# Altium project 电池架充电板.PrjPcb
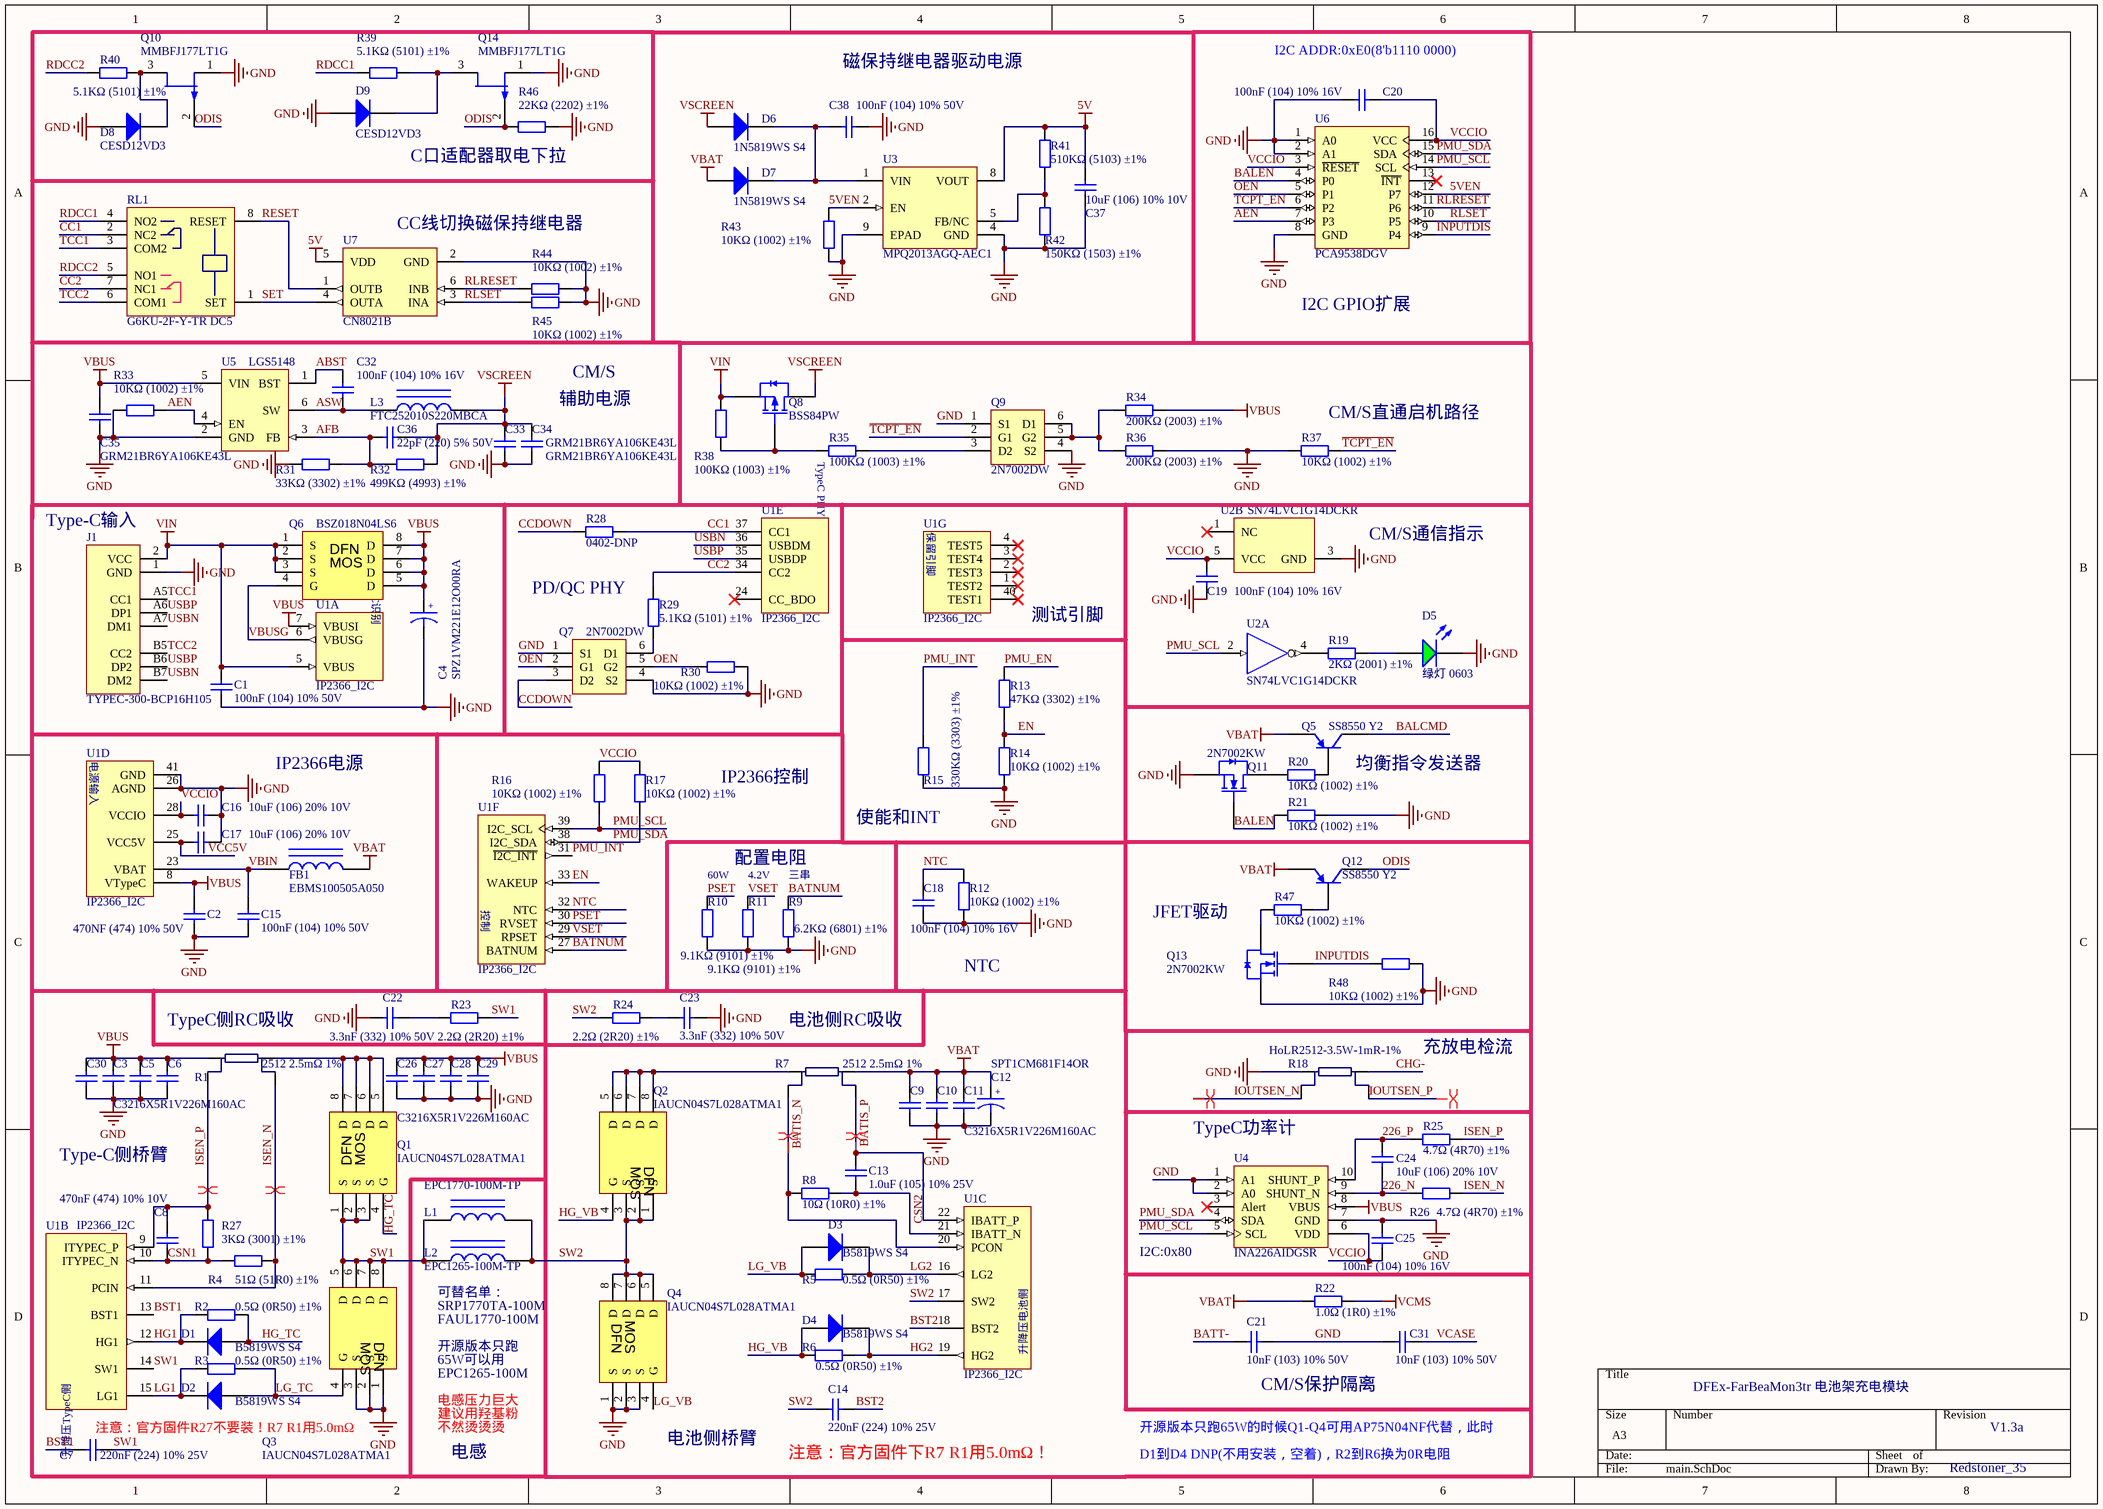
[diagram p0: main.SchDoc]
1 sheet, 122 parts. Net scope: global (net labels, ports and power ports of the same name join across sheets).
Board file: PCB2.PcbDoc

## Sheet main.SchDoc
size A3

### Parts
C1  100nF (104) 10% 50V  [0402_C]
C2  470NF (474) 10% 50V  [0402_C]
C3  C3216X5R1V226M160AC  [1206C]
C4  SPZ1VM221E12O00RA  [ElecCap_Hori]
C5  C3216X5R1V226M160AC  [1206C]  (value not drawn)
C6  C3216X5R1V226M160AC  [1206C]  (value not drawn)
C7  220nF (224) 10% 25V  [0603_C]
C8  470nF (474) 10% 10V  [0402_C]
C9  C3216X5R1V226M160AC  [1206C]  (value not drawn)
C10  C3216X5R1V226M160AC  [1206C]  (value not drawn)
C11  C3216X5R1V226M160AC  [1206C]
C12  SPT1CM681F14OR  [ElecCap_Hori]
C13  1.0uF (105) 10% 25V  [0402_C]
C14  220nF (224) 10% 25V  [0603_C]
C15  100nF (104) 10% 50V  [0402_C]
C16  10uF (106) 20% 10V  [0402_C]
C17  10uF (106) 20% 10V  [0402_C]
C18  100nF (104) 10% 16V  [0402_C]
C19  100nF (104) 10% 16V  [0402_C]
C20  100nF (104) 10% 16V  [0402_C]
C21  10nF (103) 10% 50V  [0402_C]
C22  3.3nF (332) 10% 50V  [0603_C]
C23  3.3nF (332) 10% 50V  [0603_C]
C24  10uF (106) 20% 10V  [0402_C]
C25  100nF (104) 10% 16V  [0402_C]
C26  C3216X5R1V226M160AC  [1206C]  (value not drawn)
C27  C3216X5R1V226M160AC  [1206C]
C28  C3216X5R1V226M160AC  [1206C]  (value not drawn)
C29  C3216X5R1V226M160AC  [1206C]  (value not drawn)
C30  C3216X5R1V226M160AC  [1206C]  (value not drawn)
C31  10nF (103) 10% 50V  [0402_C]
C32  100nF (104) 10% 16V  [0402_C]
C33  GRM21BR6YA106KE43L  [0805_C]
C34  GRM21BR6YA106KE43L  [0805_C]
C35  GRM21BR6YA106KE43L  [0805_C]
C36  22pF (220) 5% 50V  [0402_C]
C37  10uF (106) 10% 10V  [0603_C]
C38  100nF (104) 10% 50V  [0402_C]
D1  B5819WS S4  [SOD-323]
D2  B5819WS S4  [SOD-323]
D3  B5819WS S4  [SOD-323]
D4  B5819WS S4  [SOD-323]
D5  绿灯 0603  [0603_LED_S1]
D6  1N5819WS S4  [SOD-323]
D7  1N5819WS S4  [SOD-323]
D8  CESD12VD3  [SOD-323]
D9  CESD12VD3  [SOD-323]
FB1  EBMS100505A050  [0402_L]
J1  TYPEC-300-BCP16H105  [TYPE-C-SMD_TYPE-C16PIN]
L1  EPC1770-100M-TP  [IND1770-HD]
L2  EPC1265-100M-TP  [EPC1265-xxxM]
L3  FTC252010S220MBCA  [SWPA252010S]
Q1  IAUCN04S7L028ATMA1  [SON/DFN5x6(MOS)]
Q2  IAUCN04S7L028ATMA1  [SON/DFN5x6(MOS)]
Q3  IAUCN04S7L028ATMA1  [SON/DFN5x6(MOS)]
Q4  IAUCN04S7L028ATMA1  [SON/DFN5x6(MOS)]
Q5  SS8550 Y2  [SOT-23(SOT-23-3)]
Q6  BSZ018N04LS6  [DFN-8_L3.0-W3.0-P0.65-BL]
Q7  2N7002DW  [SC70-6]
Q8  BSS84PW  [SC70-3]
Q9  2N7002DW  [SC70-6]
Q10  MMBFJ177LT1G  [SOT-23_N]
Q11  2N7002KW  [SC70-3]
Q12  SS8550 Y2  [SC70-3]
Q13  2N7002KW  [SC70-3]
Q14  MMBFJ177LT1G  [SOT-23_N]
R1  2512 2.5mΩ 1%  [2512-Virtual4Wire]
R2  0.5Ω (0R50) ±1%  [0603_R]
R3  0.5Ω (0R50) ±1%  [0603_R]
R4  51Ω (51R0) ±1%  [0402_R]
R5  0.5Ω (0R50) ±1%  [0603_R]
R6  0.5Ω (0R50) ±1%  [0603_R]
R7  2512 2.5mΩ 1%  [2512-Virtual4Wire]
R8  10Ω (10R0) ±1%  [0402_R]
R9  6.2KΩ (6801) ±1%  [0402_R]
R10  9.1KΩ (9101) ±1%  [0402_R]
R11  9.1KΩ (9101) ±1%  [0402_R]
R12  10KΩ (1002) ±1%  [0402_R]
R13  47KΩ (3302) ±1%  [0603_R]
R14  10KΩ (1002) ±1%  [0603_R]
R15  330KΩ (3303) ±1%  [0603_R]
R16  10KΩ (1002) ±1%  [0402_R]
R17  10KΩ (1002) ±1%  [0402_R]
R18  HoLR2512-3.5W-1mR-1%  [2512-Virtual4Wire]
R19  2KΩ (2001) ±1%  [0402_R]
R20  10KΩ (1002) ±1%  [0402_R]
R21  10KΩ (1002) ±1%  [0402_R]
R22  1.0Ω (1R0) ±1%  [0805_R]
R23  2.2Ω (2R20) ±1%  [0603_R]
R24  2.2Ω (2R20) ±1%  [0603_R]
R25  4.7Ω (4R70) ±1%  [0402_R]
R26  4.7Ω (4R70) ±1%  [0402_R]
R27  3KΩ (3001) ±1%  [0402_R]
R28  0402-DNP  [0402_R]
R29  5.1KΩ (5101) ±1%  [0402_R]
R30  10KΩ (1002) ±1%  [0402_R]
R31  33KΩ (3302) ±1%  [0402_R]
R32  499KΩ (4993) ±1%  [0402_R]
R33  10KΩ (1002) ±1%  [0402_R]
R34  200KΩ (2003) ±1%  [0402_R]
R35  100KΩ (1003) ±1%  [0402_R]
R36  200KΩ (2003) ±1%  [0402_R]
R37  10KΩ (1002) ±1%  [0402_R]
R38  100KΩ (1003) ±1%  [0402_R]
R39  5.1KΩ (5101) ±1%  [0402_R]
R40  5.1KΩ (5101) ±1%  [0402_R]
R41  510KΩ (5103) ±1%  [0402_R]
R42  150KΩ (1503) ±1%  [0402_R]
R43  10KΩ (1002) ±1%  [0402_R]
R44  10KΩ (1002) ±1%  [0402_R]
R45  10KΩ (1002) ±1%  [0402_R]
R46  22KΩ (2202) ±1%  [0402_R]
R47  10KΩ (1002) ±1%  [0402_R]
R48  10KΩ (1002) ±1%  [0402_R]
RL1  G6KU-2F-Y-TR DC5  [RELAY-SMD_G6K-2F-Y]
U1  IP2366_I2C  [QFN40-IP2366]  (parts A,B,C,D,E,F,G of 7)
U2  SN74LVC1G14DCKR  [DCK0005A_N]  (parts A,B of 2)
U3  MPQ2013AGQ-AEC1  [MPQ2013A-QFN8]
U4  INA226AIDGSR  [MSOP-10]
U5  LGS5148  [SOT95P245X110-6N]
U6  PCA9538DGV  [TVSOP-16_L3.6-W4.4-P0.40-LS6.4-BL]
U7  CN8021B  [SOT95P245X110-6N]

### Nets
5V: C37.1 R41.2 U3.8(VOUT) U7.5(VDD)
GND: C1.1 C2.1 C3.1 C4.2 C5.1 C6.1 C9.1 C10.1 C11.1 C12.2 C15.1 C16.2 C17.2 C18.1 C19.1 C20.1 C21.2 C22.1 C23.1 C25.2 C26.1 C27.1 C28.1 C29.1 C30.1 C31.1 C33.1 C34.1 C35.1 C37.2 C38.2 D5.K D8.1(A) D9.1(A) J1.1(GND) Q3.1(S) Q3.2(S) Q3.3(S) Q4.1(S) Q4.2(S) Q4.3(S) Q7.1(S1) Q7.4(S2) Q9.1(S1) Q9.4(S2) Q10.1(D) Q11.2(S) Q13.2(S) Q14.1(D) R9.1 R10.1 R11.1 R12.1 R14.1 R15.1 R18.1(CIN) R21.1 R30.2 R31.1 R33.2 R36.2 R37.2 R42.1 R43.1 R44.1 R45.1 R46.2 R48.2 U1.26(AGND) U1.41(GND) U2.3(GND) U3.4(GND) U3.9(EPAD) U4.1(A1) U4.2(A0) U4.7(GND) U5.2(GND) U6.1(A0) U6.2(A1) U6.8(GND) U7.2(GND)
VBAT: C9.2 C10.2 C11.2 C12.1 D7.1(A) FB1.2 Q5.2(E) Q12.2(E) R7.1(CIN) R22.1
VBUS: C2.2 C3.2 C4.1 C5.2 C6.2 C26.2 C27.2 C28.2 C29.2 C30.2 C35.2 Q6.5(D) Q6.6(D) Q6.7(D) Q6.8(D) R1.0(CIN) R34.2 U1.7(VBUSI) U1.8(VTypeC) U4.8(VBUS) U5.5(VIN)
VCMS: R22.2
VIN: C1.2 J1.2(VCC) Q6.1(S) Q6.2(S) Q6.3(S) Q8.2(S) R38.2 U1.5(VBUS)
VSCREEN: C33.2 C34.2 C36.2 D6.1(A) L3.1 Q8.3(D) R32.2
5VEN: R43.2 U3.2(EN) U6.12(P7)
226_N: C24.1 R26.1 U4.9(SHUNT_N)
226_P: C24.2 R25.1 U4.10(SHUNT_P)
~{TCPT_EN}: Q9.2(G1) R37.1 U6.6(P2)
ABST: C32.2 U5.1(BST)
AEN: R33.1 U5.4(EN) U6.7(P3)
AFB: C36.1 R31.2 R32.1 U5.3(FB)
ASW: C32.1 L3.2 U5.6(SW)
BALCMD: Q5.3(C)
BALEN: Q11.1(G) R21.2 U6.4(P0)
BATIS_N: R7.2(CIN) R8.1 U1.20(PCON)
BATIS_P: C13.2 R7.3(CIN) U1.22(IBATT_P)
BATNUM: R9.2 U1.27(BATNUM)
BATT-: C21.1
BST1: C7.1 U1.13(BST1)
BST2: C14.2 U1.18(BST2)
CC1: R28.2 RL1.2(NC2) U1.37(CC1)
CC2: R29.2 RL1.7(NC1) U1.34(CC2)
CCDOWN: Q7.3(D2) R28.1
CHG-: R18.0(CIN)
CSN1: C8.1 R4.1 R27.1 U1.10(ITYPEC_N)
CSN2: C13.1 R8.2 U1.21(IBATT_N)
EN: R13.1 R14.2 U1.33(WAKEUP)
HG1: D1.2(K) R2.1 U1.12(HG1)
HG2: D4.2(K) R6.2 U1.19(HG2)
HG_TC: D1.1(A) Q1.4(G) R2.2
HG_VB: D4.1(A) Q2.4(G) R6.1
INPUTDIS: Q13.1(G) R48.1 U6.9(P4)
IOUTSEN_N: R18.3(CIN)
IOUTSEN_P: R18.2(CIN)
ISEN_N: R1.3(CIN) R4.2 R26.2 U1.11(PCIN)
ISEN_P: C8.2 R1.2(CIN) R25.2 R27.2 U1.9(ITYPEC_P)
LG1: D2.2(K) R3.1 U1.15(LG1)
LG2: D3.2(K) R5.2 U1.16(LG2)
LG_TC: D2.1(A) Q3.4(G) R3.2
LG_VB: D3.1(A) Q4.4(G) R5.1
NTC: C18.2 R12.2 U1.32(NTC)
ODIS: Q10.2(G) Q12.3(C) Q14.2(G) R46.1
OEN: Q7.2(G1) Q7.5(G2) R30.1 U6.5(P1)
PMU_EN: R13.2
PMU_INT: R15.2 U1.31(~{I2C_INT})
PMU_SCL: R16.1 U1.39(I2C_SCL) U2.2(A) U4.5(SCL) U6.14(SCL)
PMU_SDA: R17.1 U1.38(I2C_SDA) U4.4(SDA) U6.15(SDA)
PSET: R10.2 U1.30(RVSET)
RDCC1: R39.1 RL1.4(NO2)
RDCC2: R40.1 RL1.5(NO1)
RESET: RL1.8(RESET) U7.1(OUTB)
RLRESET: R44.2 U6.11(P6) U7.6(INB)
RLSET: R45.2 U6.10(P5) U7.3(INA)
SET: RL1.1(SET) U7.4(OUTA)
SW1: C7.2 L1.1 L2.1 Q1.1(S) Q1.2(S) Q1.3(S) Q3.5(D) Q3.6(D) Q3.7(D) Q3.8(D) R23.2 U1.14(SW1)
SW2: C14.1 L1.2 L2.2 Q2.1(S) Q2.2(S) Q2.3(S) Q4.5(D) Q4.6(D) Q4.7(D) Q4.8(D) R24.2 U1.17(SW2)
TCC1: J1.A5(CC1) RL1.3(COM2)
TCC2: J1.B5(CC2) RL1.6(COM1)
USBN: J1.A7(DM1) J1.B7(DM2) U1.36(USBDM)
USBP: J1.A6(DP1) J1.B6(DP2) U1.35(USBDP)
VBIN: C15.2 FB1.1 U1.23(VBAT)
VBUSG: Q6.4(G) U1.6(VBUSG)
VCASE: C31.2
VCC5V: C17.1 U1.25(VCC5V)
VCCIO: C16.1 C19.2 C20.2 C25.1 R16.2 R17.2 U1.28(VCCIO) U2.5(VCC) U4.6(VDD) U6.3(~{RESET}) U6.16(VCC)
VSET: R11.2 U1.29(RPSET)
NetC22_2: C22.2 R23.1
NetC23_2: C23.2 R24.1
NetC38_1: C38.1 D6.2(K) D7.2(K) U3.1(VIN)
NetD5_A: D5.A R19.2
NetD8_2: D8.2(K) Q10.3(S) R40.2
NetD9_2: D9.2(K) Q14.3(S) R39.2
NetQ1_5: Q1.5(D) Q1.6(D) Q1.7(D) Q1.8(D) R1.1(CIN)
NetQ2_5: Q2.5(D) Q2.6(D) Q2.7(D) Q2.8(D) R7.0(CIN)
NetQ5_1: Q5.1(B) R20.2
NetQ7_6: Q7.6(D1) R29.1
NetQ8_1: Q8.1(G) R35.2 R38.1
NetQ9_3: Q9.3(D2) R35.1
NetQ9_5: Q9.5(G2) Q9.6(D1) R34.1 R36.1
NetQ11_3: Q11.3(D) R20.1
NetQ12_1: Q12.1(B) R47.2
NetQ13_3: Q13.3(D) R47.1
NetR19_1: R19.1 U2.4(Y)
NetR41_1: R41.1 R42.2 U3.5(FB/NC)

Not connected (* = marked no-connect by the designer): U1 1(TEST2)* 2(TEST3)* 3(TEST4)* 4(TEST5)* 24(CC_BDO)* 40(TEST1)*; U2 1(NC)*; U4 3(Alert)*; U6 13(~{INT})*

### Layout directives
differential pair: BATIS_N, BATIS_P, IOUTSEN_N, IOUTSEN_P, ISEN_N, ISEN_P

### Notes on the sheet
- 磁保持继电器驱动电源
- (near C20) I2C ADDR:0xE0(8'b1110 0000)
- C口适配器取电下拉
- (near U7) CC线切换磁保持继电器
- I2C GPIO扩展
- CM/S
- 辅助电源
- (near R37) CM/S直通启机路径
- (near J1) Type-C输入
- CM/S通信指示
- PD/QC PHY
- 测试引脚
- IP2366电源
- IP2366控制
- (near Q5) 均衡指令发送器
- (near R15) 使能和INT
- 60W
- 配置电阻
- 4.2V
- (near R9) 三串
- JFET驱动
- NTC
- TypeC侧RC吸收
- (near R7) 电池侧RC吸收
- 充放电检流
- Type-C侧桥臂
- TypeC功率计
- (near U4) I2C:0x80
- (near L2) 可替名单：
- SRP1770TA-100M
- FAUL1770-100M
- 开源版本只跑
- 65W可以用
- EPC1265-100M
- (near C21) CM/S保护隔离
- DFEx-FarBeaMon3tr 电池架充电模块
- (near C7) 注意：官方固件R27不要装！R7 R1用5.0mΩ
- 电感压力巨大
- 建议用羟基粉
- 不然烫烫烫
- 电感
- (near Q4) 电池侧桥臂
- (near C14) 注意：官方固件下R7 R1用5.0mΩ！
- 开源版本只跑65W的时候Q1-Q4可用AP75N04NF代替，此时
- D1到D4 DNP(不用安装，空着)，R2到R6换为0R电阻
- V1.3a
- Redstoner_35
- (in symbol CAP2) +
- (in symbol IP2366_I2C, part A) TypeC识别
- (in symbol IP2366_I2C, part B) 升降压TypeC侧
- (in symbol IP2366_I2C, part C) 升降压电池侧
- (in symbol IP2366_I2C, part D) 电源输入
- (in symbol IP2366_I2C, part E) TypeC PHY
- (in symbol IP2366_I2C, part F) 控制
- (in symbol IP2366_I2C, part G) 保留引脚
- (in symbol SON/DFN5x6 MOS) DFN; MOS

### Library data of the parts
C1 C15 C18-C20 C25 C32 C38 = 0402 100nF (104) 10% 16V: 贴片电容; ComponentLink1Description: 供应商链接; ComponentLink1URL: http://www.szlcsc.com/product/details_1877.html; Package: 0402; Supplier: LC; SuppliersPartNumber: C1525
C2 C13 = 0402 1.0uF (105) 10% 25V: 贴片电容; ComponentLink1Description: 供应商链接; ComponentLink1URL: http://www.szlcsc.com/product/details_53938.html; Package: 0402; Supplier: LC; SuppliersPartNumber: C52923
C3 C5 C6 C9-C11 C26-C30 = Cap: 1206尺寸TDK MLCC 35V 22uF; Published: 8-Jun-2000; LatestRevisionDate: 17-Jul-2002; LatestRevisionNote: Re-released for DXP Platform.; PackageReference: RAD-0.3; Publisher: Altium Limited; PackageDescription: Radial Cap, Thru-Hole; 2 Leads; 0.3 in Pin Spacing; Value: 22uF
C4 = CAP2: 直插固态电容，耐压35V容量220uF，尺寸6x11
C7 C14 = 0603 220nF (224) 10% 25V: 贴片电容; ComponentLink1Description: 供应商链接; ComponentLink1URL: http://www.szlcsc.com/product/details_21832.html; Package: 0603; Supplier: LC; SuppliersPartNumber: C21120
C8 = 0402 470nF (474) 10% 10V: 贴片电容; ComponentLink1Description: 供应商链接; ComponentLink1URL: http://www.szlcsc.com/product/details_48344.html; Package: 0402; Supplier: LC; SuppliersPartNumber: C47339
C12 = CAP2: 直插固态电容，耐压16V容量680uF，尺寸6x11
C16 C17 C24 = 0402 10uF (106) 20% 6.3V: 贴片电容; ComponentLink1Description: 供应商链接; ComponentLink1URL: http://www.szlcsc.com/product/details_16204.html; Package: 0402; Supplier: LC; SuppliersPartNumber: C15525
C21 C31 = 0402 10nF (103) 10% 50V: 贴片电容; ComponentLink1Description: 供应商链接; ComponentLink1URL: http://www.szlcsc.com/product/details_15869.html; Package: 0402; Supplier: LC; SuppliersPartNumber: C15195
C22 C23 = 0603 3.3nF (332) 10% 50V: 贴片电容; ComponentLink1Description: 供应商链接; ComponentLink1URL: http://www.szlcsc.com/product/details_1965.html; Package: 0603; Supplier: LC; SuppliersPartNumber: C1613
C33 C34 = 0805 22uF (226) 20% 25V: 0805 10uF±10% 35V X5R贴片电容; ComponentLink1Description: 供应商链接; ComponentLink1URL: http://www.szlcsc.com/product/details_46786.html; Package: 0805; Supplier: LC; SuppliersPartNumber: C45783
C35 = 0805 4.7uF (475) 10% 25V: 0805 10uF±10% 35V X5R贴片电容; ComponentLink1Description: 供应商链接; ComponentLink1URL: http://www.szlcsc.com/product/details_2131.html; Package: 0805; Supplier: LC; SuppliersPartNumber: C1779
C36 = 0402 22pF (220) 5% 50V: 贴片电容; ComponentLink1Description: 供应商链接; ComponentLink1URL: http://www.szlcsc.com/product/details_1907.html; Package: 0402; Supplier: LC; SuppliersPartNumber: C1555
C37 = 0603 10uF (106) 10% 10V: 贴片电容; ComponentLink1Description: 供应商链接; ComponentLink1URL: http://www.szlcsc.com/product/details_20411.html; Package: 0603; Supplier: LC; SuppliersPartNumber: C19702
D1-D4 D6 D7 = SOD-323 1N4148WS T4: 二极管; ComponentLink1Description: 供应商链接; ComponentLink1URL: http://www.szlcsc.com/product/details_2485.html; Package: SOD-323; Supplier: LC; SuppliersPartNumber: C2128
D5 = 0603 绿灯: 发光二极管; ComponentLink1Description: 供应商链接; ComponentLink1URL: http://www.szlcsc.com/product/details_73152.html; Package: 0603; Supplier: LC; SuppliersPartNumber: C72043
D8 D9 = SOD-323 1N4148WS T4: TVS瞬态抑制二极管，12V击穿电压; ComponentLink1Description: 供应商链接; ComponentLink1URL: http://www.szlcsc.com/product/details_2485.html; Package: SOD-323; Supplier: LC; SuppliersPartNumber: C2128
FB1 = 0402 12nH  5%: 贴片磁珠 200mA 5R±25% 100MHz; ComponentLink1Description: 供应商链接; ComponentLink1URL: http://www.szlcsc.com/product/details_25303.html; Package: 0402; Supplier: LC; SuppliersPartNumber: C24563
J1 = TYPEC-300-BCP16H105: 立贴16Pin Type-C接口，总高度10.5mm
L1 = Inductor Iron: 汇磁一体成型羟基粉电感，1770尺寸，10uH±20% 9.50mΩ DCR 25A饱和电流; Value: 10uH; Published: 24-Mar-1999; LatestRevisionDate: 17-Jul-2002; LatestRevisionNote: Re-released for DXP Platform.; PackageReference: AXIAL-0.9; Publisher: Altium Limited; PackageDescription: Axial Device, Thru-Hole; 2 Leads; 0.9 in Pin Spacing
L2 = Inductor Iron: 汇磁一体成型羟基粉电感，1265尺寸，10uH±20%; Value: 10uH; Published: 24-Mar-1999; LatestRevisionDate: 17-Jul-2002; LatestRevisionNote: Re-released for DXP Platform.; PackageReference: AXIAL-0.9; Publisher: Altium Limited; PackageDescription: Axial Device, Thru-Hole; 2 Leads; 0.9 in Pin Spacing
L3 = Inductor Iron: 小型化一体成型T-CORE热压电感，22uH 2.5*2.0*1.0mm尺寸; Value: 4.7uH; Published: 24-Mar-1999; LatestRevisionDate: 17-Jul-2002; LatestRevisionNote: Re-released for DXP Platform.; PackageReference: AXIAL-0.9; Publisher: Altium Limited; PackageDescription: Axial Device, Thru-Hole; 2 Leads; 0.9 in Pin Spacing
Q1-Q4 = SON/DFN5x6 MOS: 40V, N-Ch, 2.80mΩ max, Automotive MOSFET, SSO8(5x6), OptiMOS™ 7
Q5 = SOT-23 SS8550 Y2: 三极管; ComponentLink1Description: 供应商链接; ComponentLink1URL: http://www.szlcsc.com/product/details_9037.html; Package: SOT-23; Supplier: LC; SuppliersPartNumber: C8542
Q6 = SON/DFN5x6 MOS: PDFN3x3 40V 60A 1.8mΩ N-Ch MOSFET
Q7 Q9 = 2N7002DW: Dual N-Channel MOSFET 60V340mA SOT-363
Q8 = SI2301CDS-T1-GE3: MOS(场效应管); ComponentLink1Description: 供应商链接; ComponentLink1URL: http://www.szlcsc.com/product/details_11030.html; Package: SOT-23(SOT-23-3); Supplier: LC; SuppliersPartNumber: C10487
Q10 Q14 = JFET-P: SOT-23-3耗尽型场效应管; pin to pad: 1>2 2>3 3>1; Published: 8-Jun-2000; LatestRevisionDate: 17-Jul-2002; LatestRevisionNote: Re-released for DXP Platform.; PackageReference: TO-18A; Publisher: Altium Limited; PackageDescription: SC-89; 3 Flat Leads; Body 1.6 x 1.6 x 0.7 mm, inc leads (LxWxH typ)
Q11 Q13 = 2N7002 7002: 单N沟道MOSFET(场效应管); ComponentLink1Description: 供应商链接; ComponentLink1URL: http://www.szlcsc.com/product/details_9040.html; Package: SOT-323; Supplier: LC; SuppliersPartNumber: C???????
Q12 = SOT-23 SS8550 Y2: PNP三极管，SOT-323 封装; ComponentLink1Description: 供应商链接; ComponentLink1URL: http://www.szlcsc.com/product/details_9037.html; Package: SOT-23; Supplier: LC; SuppliersPartNumber: C8542
R1 R7 = shunt: 2512尺寸高能电子束焊接合金检流电阻，2.5mΩ 3W 1%
R2 R3 = 0603 0Ω (0R0) 1%: 贴片电阻; ComponentLink1Description: 供应商链接; ComponentLink1URL: http://www.szlcsc.com/product/details_21903.html; Package: 0603; Supplier: LC; SuppliersPartNumber: C21189
R4 = 0402 51Ω (51R0) 1%: 贴片电阻; ComponentLink1Description: 供应商链接; ComponentLink1URL: http://www.szlcsc.com/product/details_25868.html; Package: 0402; Supplier: LC; SuppliersPartNumber: C25125
R5 R6 = 0603 1.5KΩ (1501) 1%: 贴片电阻; ComponentLink1Description: 供应商链接; ComponentLink1URL: http://www.szlcsc.com/product/details_23570.html; Package: 0603; Supplier: LC; SuppliersPartNumber: C22843
R8 = 0402 10Ω (10R0) 1%: 贴片电阻; ComponentLink1Description: 供应商链接; ComponentLink1URL: http://www.szlcsc.com/product/details_25820.html; Package: 0402; Supplier: LC; SuppliersPartNumber: C25077
R9-R11 = 0402 6.8KΩ (6801) 1%: 贴片电阻; ComponentLink1Description: 供应商链接; ComponentLink1URL: http://www.szlcsc.com/product/details_26660.html; Package: 0402; Supplier: LC; SuppliersPartNumber: C25917
R12 R16 R17 R20 R21 R30 R33 R37 R43-R45 R47 R48 = 0402 10KΩ (1002) 1%: 贴片电阻; ComponentLink1Description: 供应商链接; ComponentLink1URL: http://www.szlcsc.com/product/details_26487.html; Package: 0402; Supplier: LC; SuppliersPartNumber: C25744
R13 = 0603 33KΩ (3302) 1%: 贴片电阻; ComponentLink1Description: 供应商链接; ComponentLink1URL: http://www.szlcsc.com/product/details_4623.html; Package: 0603; Supplier: LC; SuppliersPartNumber: C4216
R14 = 0603 10KΩ (1002) 1%: 贴片电阻; ComponentLink1Description: 供应商链接; ComponentLink1URL: http://www.szlcsc.com/product/details_26547.html; Package: 0603; Supplier: LC; SuppliersPartNumber: C25804
R15 = 0603 330KΩ (3303) 1%: 贴片电阻; ComponentLink1Description: 供应商链接; ComponentLink1URL: http://www.szlcsc.com/product/details_23864.html; Package: 0603; Supplier: LC; SuppliersPartNumber: C23137
R18 = shunt: 2512尺寸低温飘合金检流电阻1.0mΩ 3.5W 1% TCR＜25PPM
R19 = 0402 2KΩ (2001) 1%: 贴片电阻; ComponentLink1Description: 供应商链接; ComponentLink1URL: http://www.szlcsc.com/product/details_4516.html; Package: 0402; Supplier: LC; SuppliersPartNumber: C4109
R22 = 0805 0Ω (0R0) 1%: 贴片电阻; ComponentLink1Description: 供应商链接; ComponentLink1URL: http://www.szlcsc.com/product/details_18165.html; Package: 0805; Supplier: LC; SuppliersPartNumber: C17477
R23 R24 = 0603 2.2Ω (2R20) 1%: 贴片电阻; ComponentLink1Description: 供应商链接; ComponentLink1URL: http://www.szlcsc.com/product/details_23666.html; Package: 0603; Supplier: LC; SuppliersPartNumber: C22939
R25 R26 = 0402 4.7KΩ (4701) 1%: 贴片电阻; ComponentLink1Description: 供应商链接; ComponentLink1URL: http://www.szlcsc.com/product/details_26643.html; Package: 0402; Supplier: LC; SuppliersPartNumber: C25900
R27 = 0402 3.3KΩ (3301) 1%: 贴片电阻; ComponentLink1Description: 供应商链接; ComponentLink1URL: http://www.szlcsc.com/product/details_26633.html; Package: 0402; Supplier: LC; SuppliersPartNumber: C25890
R28 = 0402 5.1KΩ (5101) 1%: 测试焊点（特殊情况下焊贴片电阻）; ComponentLink1Description: 供应商链接; ComponentLink1URL: http://www.szlcsc.com/product/details_26648.html; Package: 0402; Supplier: LC; SuppliersPartNumber: C25905
R29 R39 R40 = 0402 5.1KΩ (5101) 1%: 贴片电阻; ComponentLink1Description: 供应商链接; ComponentLink1URL: http://www.szlcsc.com/product/details_26648.html; Package: 0402; Supplier: LC; SuppliersPartNumber: C25905
R31 = 0402 300KΩ (3003) 1%: 贴片电阻; ComponentLink1Description: 供应商链接; ComponentLink1URL: http://www.szlcsc.com/product/details_26517.html; Package: 0402; Supplier: LC; SuppliersPartNumber: C25774
R32 R41 = 0402 510KΩ (5103) 1%: 贴片电阻; ComponentLink1Description: 供应商链接; ComponentLink1URL: http://www.szlcsc.com/product/details_12170.html; Package: 0402; Supplier: LC; SuppliersPartNumber: C11616
R34 R36 = 0402 200KΩ (2003) 1%: 贴片电阻; ComponentLink1Description: 供应商链接; ComponentLink1URL: http://www.szlcsc.com/product/details_26507.html; Package: 0402; Supplier: LC; SuppliersPartNumber: C25764
R35 R38 = 0402 100KΩ (1003) 1%: 贴片电阻; ComponentLink1Description: 供应商链接; ComponentLink1URL: http://www.szlcsc.com/product/details_26484.html; Package: 0402; Supplier: LC; SuppliersPartNumber: C25741
R42 = 0402 150KΩ (1503) 1%: 贴片电阻; ComponentLink1Description: 供应商链接; ComponentLink1URL: http://www.szlcsc.com/product/details_26498.html; Package: 0402; Supplier: LC; SuppliersPartNumber: C25755
R46 = 0402 22KΩ (2202) 1%: 贴片电阻; ComponentLink1Description: 供应商链接; ComponentLink1URL: http://www.szlcsc.com/product/details_26511.html; Package: 0402; Supplier: LC; SuppliersPartNumber: C25768
RL1 = G6KU-2F-Y-TR DC5: 欧姆龙双组触点磁保持贴片继电器
U1 = IP2366_I2C: 支持多种快充协议，最高140W功率的充放电管理SoC
U2 = SN74LVC1G14DCKR: Single Schmitt-Trigger Inverter, DCK0005A, LARGE T&R; Manufacturer: Texas Instruments; VCC(Min)(V): 1.65; VCC(Max)(V): 5.5; Output Type: CMOS; ICC @ Nom Voltage(Max)(mA): 0.01; Input Type: CMOS/TTL; Bits(#): 1; F @ Nom Voltage(Max)(Mhz): 150; Rating: Catalog; Technology Family: LVC; Voltage(Nom)(V): 1.8,2.5,3.3,5; Schmitt Trigger: Yes; Output Drive (IOL/IOH)(Max)(mA): 32/-32; tpd @ Nom Voltage(Max)(ns): 11,6.5,5.5,5; Logic: Inverting; Sub-Family: Inverting Buffer/Driver; 3-State Output: No; DatasheetVersion: SCES218W; PackageReference: DCK0005A; Supplier 1: Mouser; Supplier Part Number 1: 595-SN74LVC1G14DCKR; Supplier 2: Digi-Key; Supplier Part Number 2: 296-11608-2-ND; Supplier 3: Digi-Key; Supplier Part Number 3: 296-11608-1-ND; Supplier 4: Digi-Key; Supplier Part Number 4: 296-11608-6-ND; Generic Part Number: SN74LVC1G14; Operating Temperature Range(C): -40 to 125,-40 to 85; PartNumber: SN74LVC1G14DCKR; ComponentLink1Description: Manufacturer URL; ComponentLink1URL: http://www.ti.com/; ComponentLink2Description: Datasheet; ComponentLink2URL: http://www.ti.com/lit/ds/symlink/sn74lvc1g14.pdf
U3 = MPQ2013AGQ-xx-AEC1: MPS 40V LDO with Enable pin QFN3x3 package
U4 = INA226AIDGSR: 具有警报功能的双向36V，16位，高精度I2C总线功率计
U5 = LGS5148: 48V输入，600mA同步降压转换器，SOT-23-6封装
U6 = PCA9538DGV: 具有中断输出、复位和配置寄存器的远程 8 位 I2C 和 SMBus 低功耗   I/O 扩展器
U7 = CN8023B: SOT23-6封装 双向磁保持继电器驱动IC 电压3.5-40V 450mA驱动能力